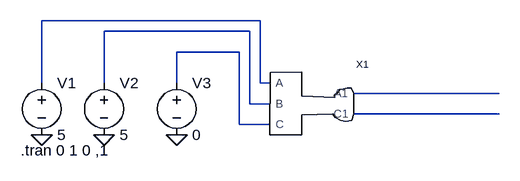
[diagram p0: schematic sum3_test.asc]
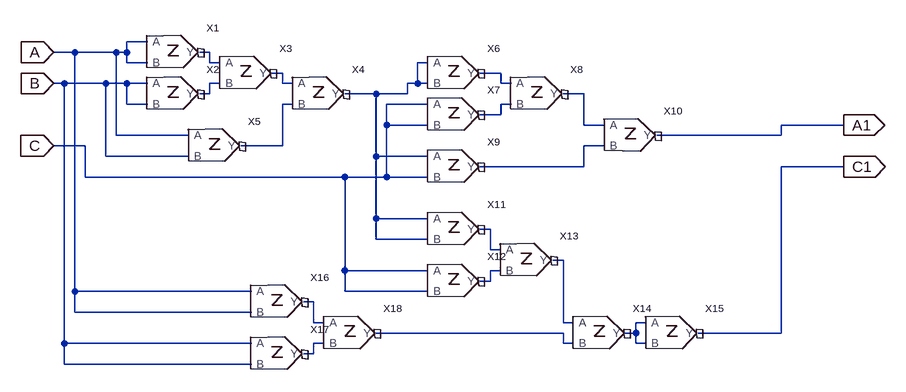
[diagram p1: sub-circuit sum3.asc]
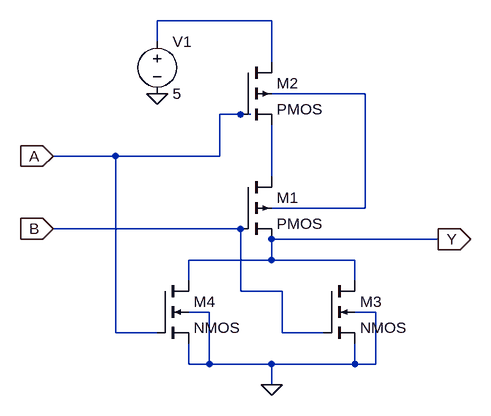
[diagram p2: sub-circuit nor.asc]
sum3_test.asc, the LTspice schematic file:
Version 4
SHEET 1 880 680
WIRE 144 48 -192 48
WIRE 128 64 -96 64
WIRE 112 96 16 96
WIRE -192 144 -192 48
WIRE -96 144 -96 64
WIRE 16 144 16 96
WIRE 144 144 144 48
WIRE 160 144 144 144
WIRE 512 160 288 160
WIRE 128 176 128 64
WIRE 160 176 128 176
WIRE 512 192 288 192
WIRE 112 208 112 96
WIRE 160 208 112 208
FLAG 16 224 0
FLAG -96 224 0
FLAG -192 224 0
SYMBOL sum3 208 176 R0
SYMATTR InstName X1
SYMBOL voltage -192 128 R0
WINDOW 123 0 0 Left 0
WINDOW 39 0 0 Left 0
SYMATTR InstName V1
SYMATTR Value 5
SYMBOL voltage -96 128 R0
WINDOW 123 0 0 Left 0
WINDOW 39 0 0 Left 0
SYMATTR InstName V2
SYMATTR Value 5
SYMBOL voltage 16 128 R0
WINDOW 123 0 0 Left 0
WINDOW 39 0 0 Left 0
SYMATTR InstName V3
SYMATTR Value 0
TEXT -224 248 Left 2 !.tran 0 1 0 ,1

sum3.asc, the sub-circuit schematic file:
Version 4
SHEET 1 1244 680
WIRE 80 96 48 96
WIRE -32 112 -64 112
WIRE 32 112 -32 112
WIRE 48 112 48 96
WIRE 48 112 32 112
WIRE 176 112 160 112
WIRE 48 128 48 112
WIRE 80 128 48 128
WIRE 176 128 176 112
WIRE 192 128 176 128
WIRE 512 128 496 128
WIRE 288 144 272 144
WIRE 624 144 592 144
WIRE -48 160 -64 160
WIRE 16 160 -48 160
WIRE 48 160 16 160
WIRE 80 160 48 160
WIRE 192 160 176 160
WIRE 288 160 288 144
WIRE 304 160 288 160
WIRE 496 160 496 128
WIRE 496 160 480 160
WIRE 512 160 496 160
WIRE 624 160 624 144
WIRE 640 160 624 160
WIRE 176 176 176 160
WIRE 176 176 160 176
WIRE 432 176 384 176
WIRE 480 176 480 160
WIRE 480 176 432 176
WIRE 752 176 720 176
WIRE 48 192 48 160
WIRE 80 192 48 192
WIRE 304 192 288 192
WIRE 512 192 448 192
WIRE 640 192 624 192
WIRE 624 208 624 192
WIRE 624 208 592 208
WIRE 448 224 448 192
WIRE 512 224 448 224
WIRE 752 224 752 176
WIRE 784 224 752 224
WIRE 1152 224 1056 224
WIRE 32 240 32 112
WIRE 144 240 32 240
WIRE 1056 240 1056 224
WIRE 1056 240 864 240
WIRE -16 256 -64 256
WIRE 288 256 288 192
WIRE 288 256 224 256
WIRE 784 256 752 256
WIRE 16 272 16 160
WIRE 144 272 16 272
WIRE 432 272 432 176
WIRE 512 272 432 272
WIRE 752 288 752 256
WIRE 752 288 592 288
WIRE 1152 288 1056 288
WIRE -16 304 -16 256
WIRE 384 304 -16 304
WIRE 448 304 448 224
WIRE 448 304 384 304
WIRE 512 304 448 304
WIRE 432 368 432 272
WIRE 512 368 432 368
WIRE 608 384 592 384
WIRE 432 400 432 368
WIRE 512 400 432 400
WIRE 608 416 608 384
WIRE 624 416 608 416
WIRE 720 432 704 432
WIRE 384 448 384 304
WIRE 512 448 384 448
WIRE 624 448 608 448
WIRE 608 464 608 448
WIRE 608 464 592 464
WIRE -32 480 -32 112
WIRE 240 480 -32 480
WIRE 384 480 384 448
WIRE 512 480 384 480
WIRE 336 496 320 496
WIRE -32 512 -32 480
WIRE 240 512 -32 512
WIRE 336 528 336 496
WIRE 352 528 336 528
WIRE 720 528 720 432
WIRE 736 528 720 528
WIRE 848 528 832 528
WIRE 720 544 432 544
WIRE 832 544 832 528
WIRE 832 544 816 544
WIRE 1056 544 1056 288
WIRE 1056 544 928 544
WIRE -48 560 -48 160
WIRE 240 560 -48 560
WIRE 352 560 336 560
WIRE 720 560 720 544
WIRE 736 560 720 560
WIRE 832 560 832 544
WIRE 848 560 832 560
WIRE 336 576 336 560
WIRE 336 576 320 576
WIRE -48 592 -48 560
WIRE 240 592 -48 592
FLAG -64 112 A
IOPIN -64 112 In
FLAG -64 160 B
IOPIN -64 160 In
FLAG -64 256 C
IOPIN -64 256 In
FLAG 1152 224 A1
IOPIN 1152 224 Out
FLAG 1152 288 C1
IOPIN 1152 288 Out
SYMBOL nor 96 128 R0
SYMATTR InstName X1
SYMBOL nor 96 192 R0
SYMATTR InstName X2
SYMBOL nor 208 160 R0
SYMATTR InstName X3
SYMBOL nor 320 192 R0
SYMATTR InstName X4
SYMBOL nor 160 272 R0
SYMATTR InstName X5
SYMBOL nor 528 160 R0
SYMATTR InstName X6
SYMBOL nor 528 224 R0
SYMATTR InstName X7
SYMBOL nor 656 192 R0
SYMATTR InstName X8
SYMBOL nor 528 304 R0
SYMATTR InstName X9
SYMBOL nor 800 256 R0
SYMATTR InstName X10
SYMBOL nor 528 400 R0
SYMATTR InstName X11
SYMBOL nor 528 480 R0
SYMATTR InstName X12
SYMBOL nor 640 448 R0
SYMATTR InstName X13
SYMBOL nor 752 560 R0
SYMATTR InstName X14
SYMBOL nor 864 560 R0
SYMATTR InstName X15
SYMBOL nor 256 512 R0
SYMATTR InstName X16
SYMBOL nor 256 592 R0
SYMATTR InstName X17
SYMBOL nor 368 560 R0
SYMATTR InstName X18

nor.asc, the sub-circuit schematic file:
Version 4
SHEET 1 880 680
WIRE 160 -80 -16 -80
WIRE -16 -48 -16 -80
WIRE 160 -16 160 -80
WIRE 304 32 160 32
WIRE 112 64 80 64
WIRE 128 64 112 64
WIRE -80 128 -176 128
WIRE 80 128 80 64
WIRE 80 128 -80 128
WIRE 160 160 160 80
WIRE 304 208 304 32
WIRE 304 208 160 208
WIRE 112 240 -176 240
WIRE 416 256 160 256
WIRE 160 288 160 256
WIRE 160 288 32 288
WIRE 288 288 160 288
WIRE 32 320 32 288
WIRE 288 320 288 288
WIRE 112 336 112 240
WIRE 176 336 112 336
WIRE 64 368 32 368
WIRE 320 368 288 368
WIRE -80 400 -80 128
WIRE -16 400 -80 400
WIRE 176 400 176 336
WIRE 240 400 176 400
WIRE 32 448 32 416
WIRE 64 448 64 368
WIRE 64 448 32 448
WIRE 160 448 64 448
WIRE 288 448 288 416
WIRE 288 448 160 448
WIRE 320 448 320 368
WIRE 320 448 288 448
WIRE 160 480 160 448
FLAG 416 256 Y
IOPIN 416 256 Out
FLAG -176 128 A
IOPIN -176 128 In
FLAG -176 240 B
IOPIN -176 240 In
FLAG 160 480 0
FLAG -16 32 0
SYMBOL pmos4 112 160 R0
SYMATTR InstName M1
SYMBOL pmos4 112 -16 R0
SYMATTR InstName M2
SYMBOL voltage -16 -64 R0
SYMATTR InstName V1
SYMATTR Value 5
SYMBOL nmos4 240 320 R0
SYMATTR InstName M3
SYMBOL nmos4 -16 320 R0
SYMATTR InstName M4

The netlist it stands for:
* sum3_test.asc
XX1 N001 N002 N003 N004 N005 sum3
V1 N001 0 5
V2 N002 0 5
V3 N003 0 0

* block symbol definitions
.subckt sum3 A B C A1 C1
XX1 A A N001 nor
XX2 B B N005 nor
XX3 N001 N005 N003 nor
XX4 N003 N007 N002 nor
XX5 A B N007 nor
XX6 N002 N002 N004 nor
XX7 C C N008 nor
XX8 N004 N008 N006 nor
XX9 N002 C N009 nor
XX10 N006 N009 A1 nor
XX11 N002 N002 N010 nor
XX12 C C N012 nor
XX13 N010 N012 N011 nor
XX14 N011 N015 N014 nor
XX15 N014 N014 C1 nor
XX16 A A N013 nor
XX17 B B N016 nor
XX18 N013 N016 N015 nor
.ends sum3

.subckt nor A B Y
M1 N003 B Y N002 PMOS
M2 N001 A N003 N002 PMOS
V1 N001 0 5
M3 Y B 0 0 NMOS
M4 Y A 0 0 NMOS
.ends nor

.model NMOS NMOS
.model PMOS PMOS
.lib standard.mos
.tran 0 1 0 ,1
.backanno
.end